# Altium schematic sheet OBC Subsystem_AVR.SchDoc
size A1; SheetNumber: 1; SheetTotal: 1
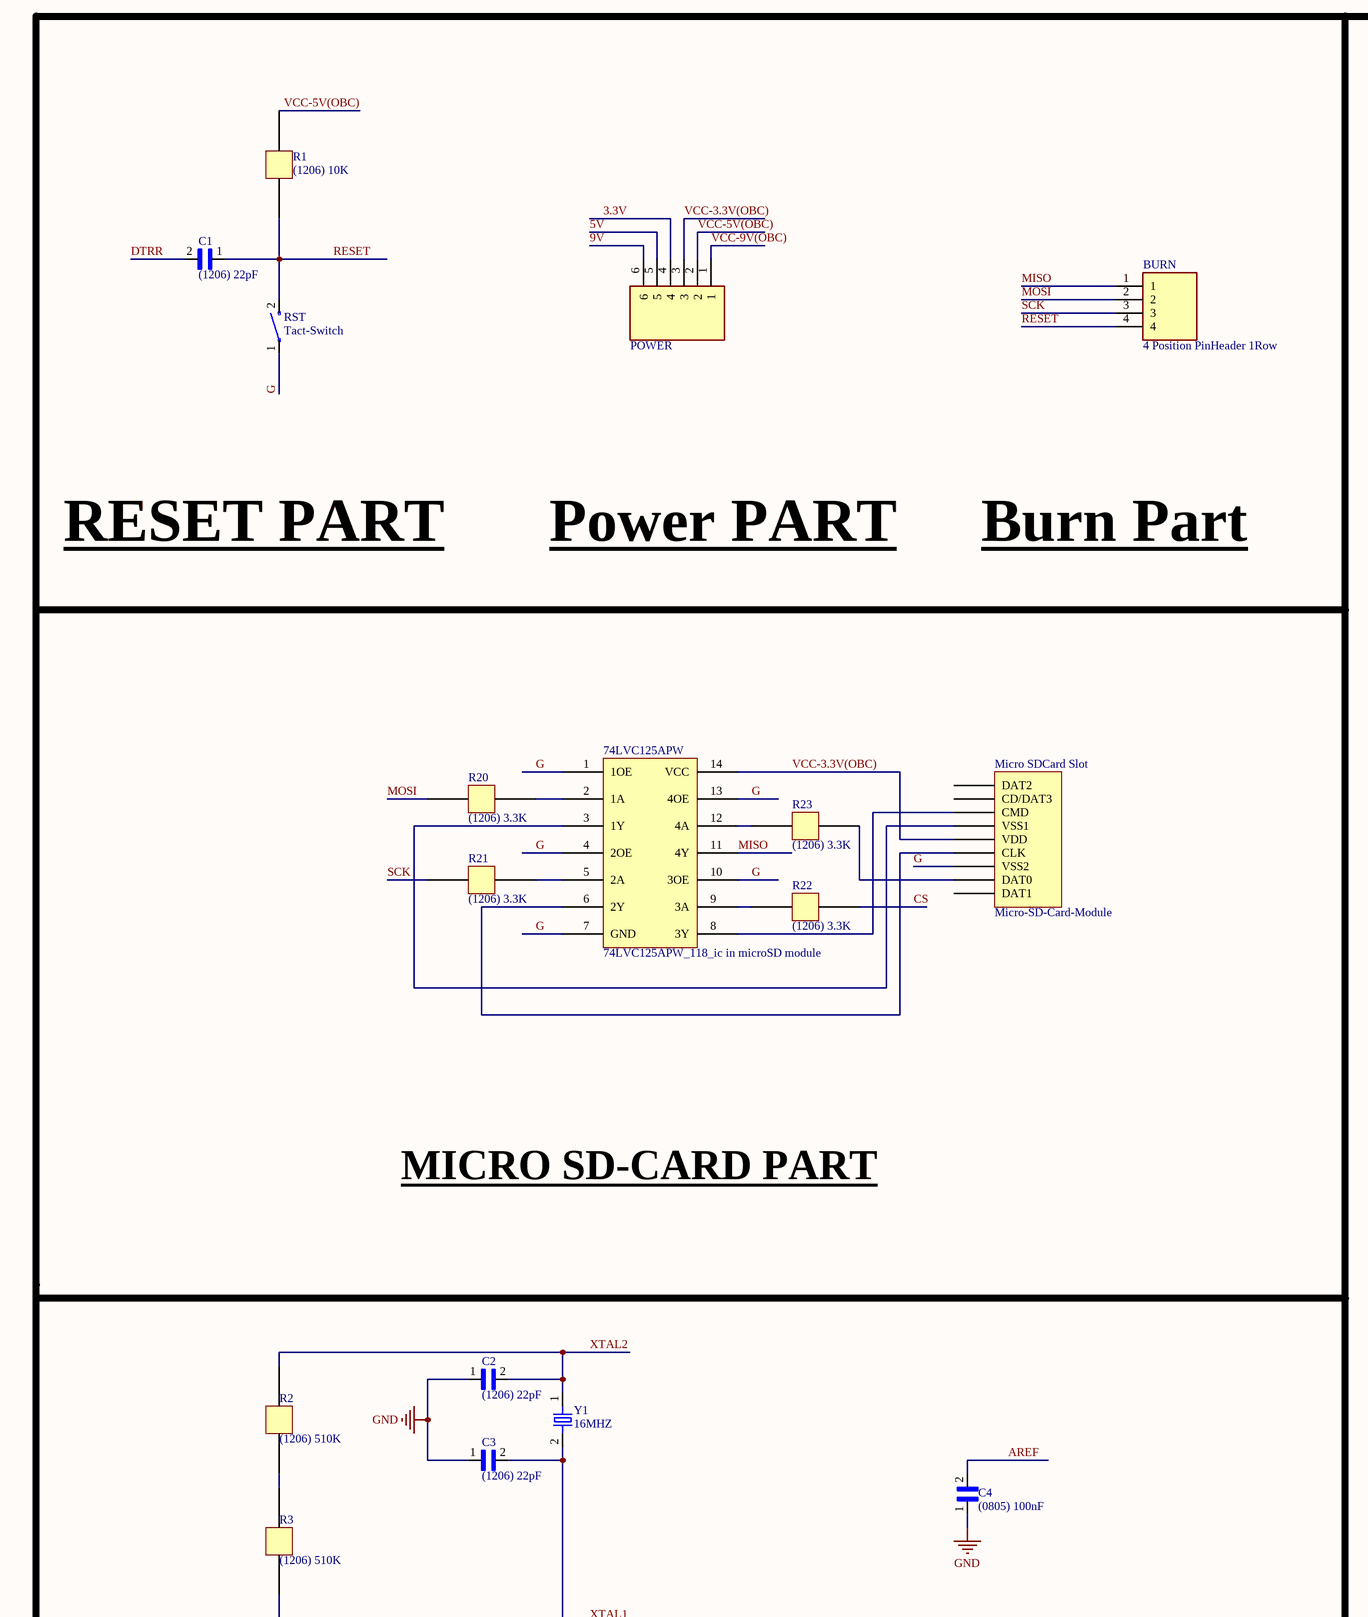
[diagram p0: OBC Subsystem_AVR.SchDoc, top left]
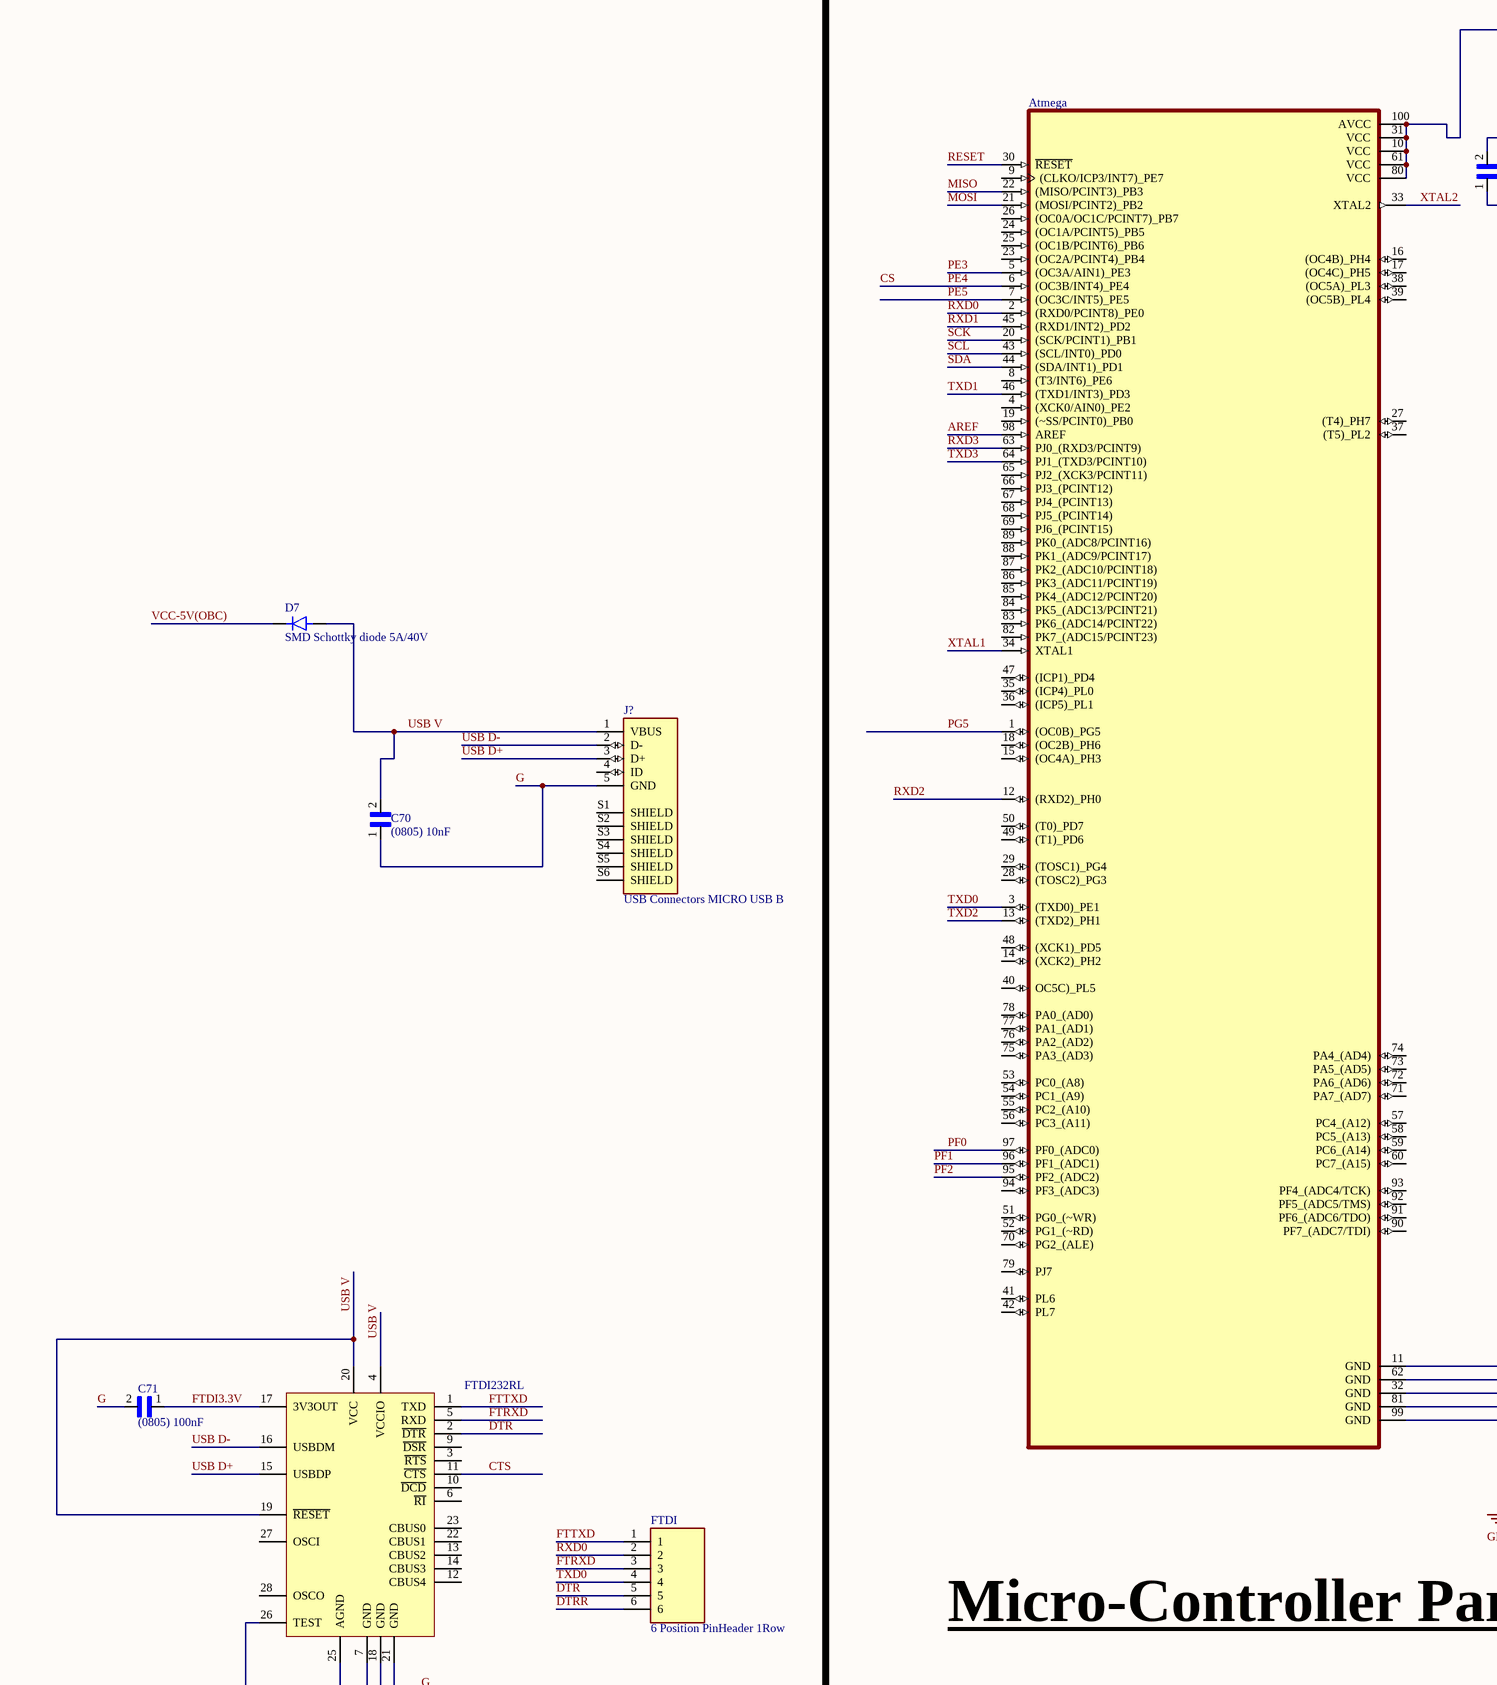
[diagram p1: OBC Subsystem_AVR.SchDoc, top middle]
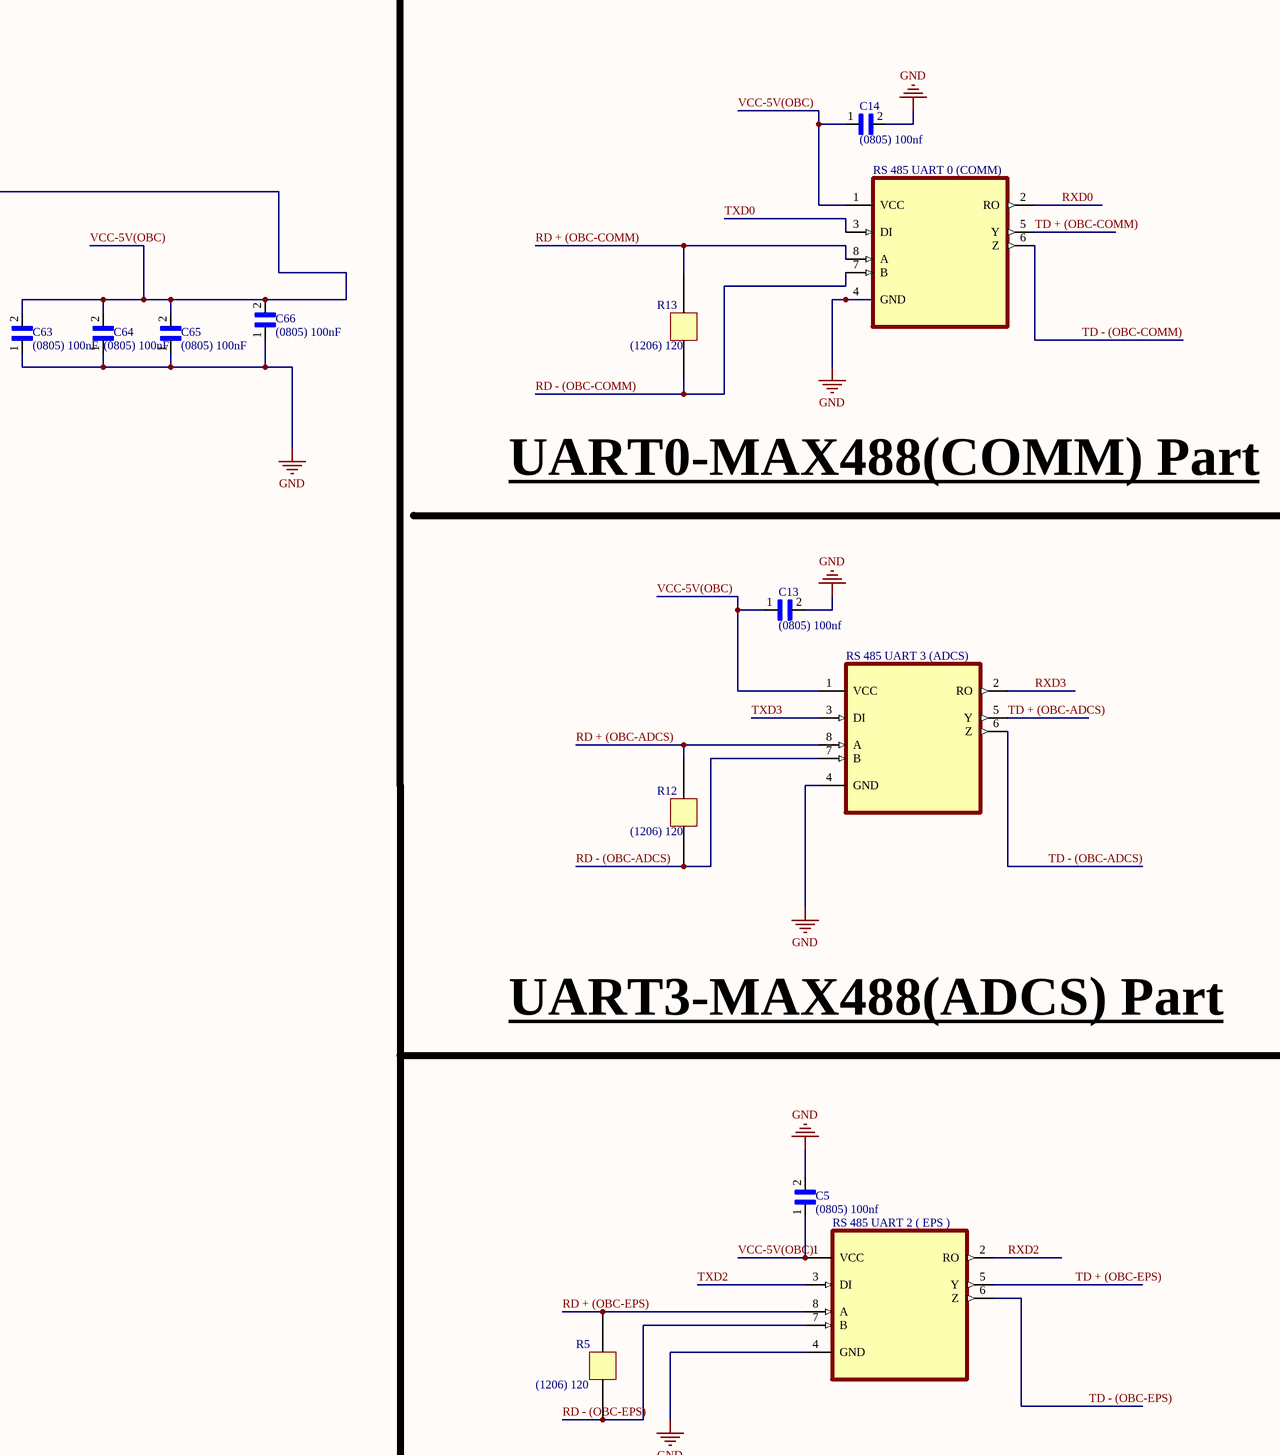
[diagram p2: OBC Subsystem_AVR.SchDoc, top right]
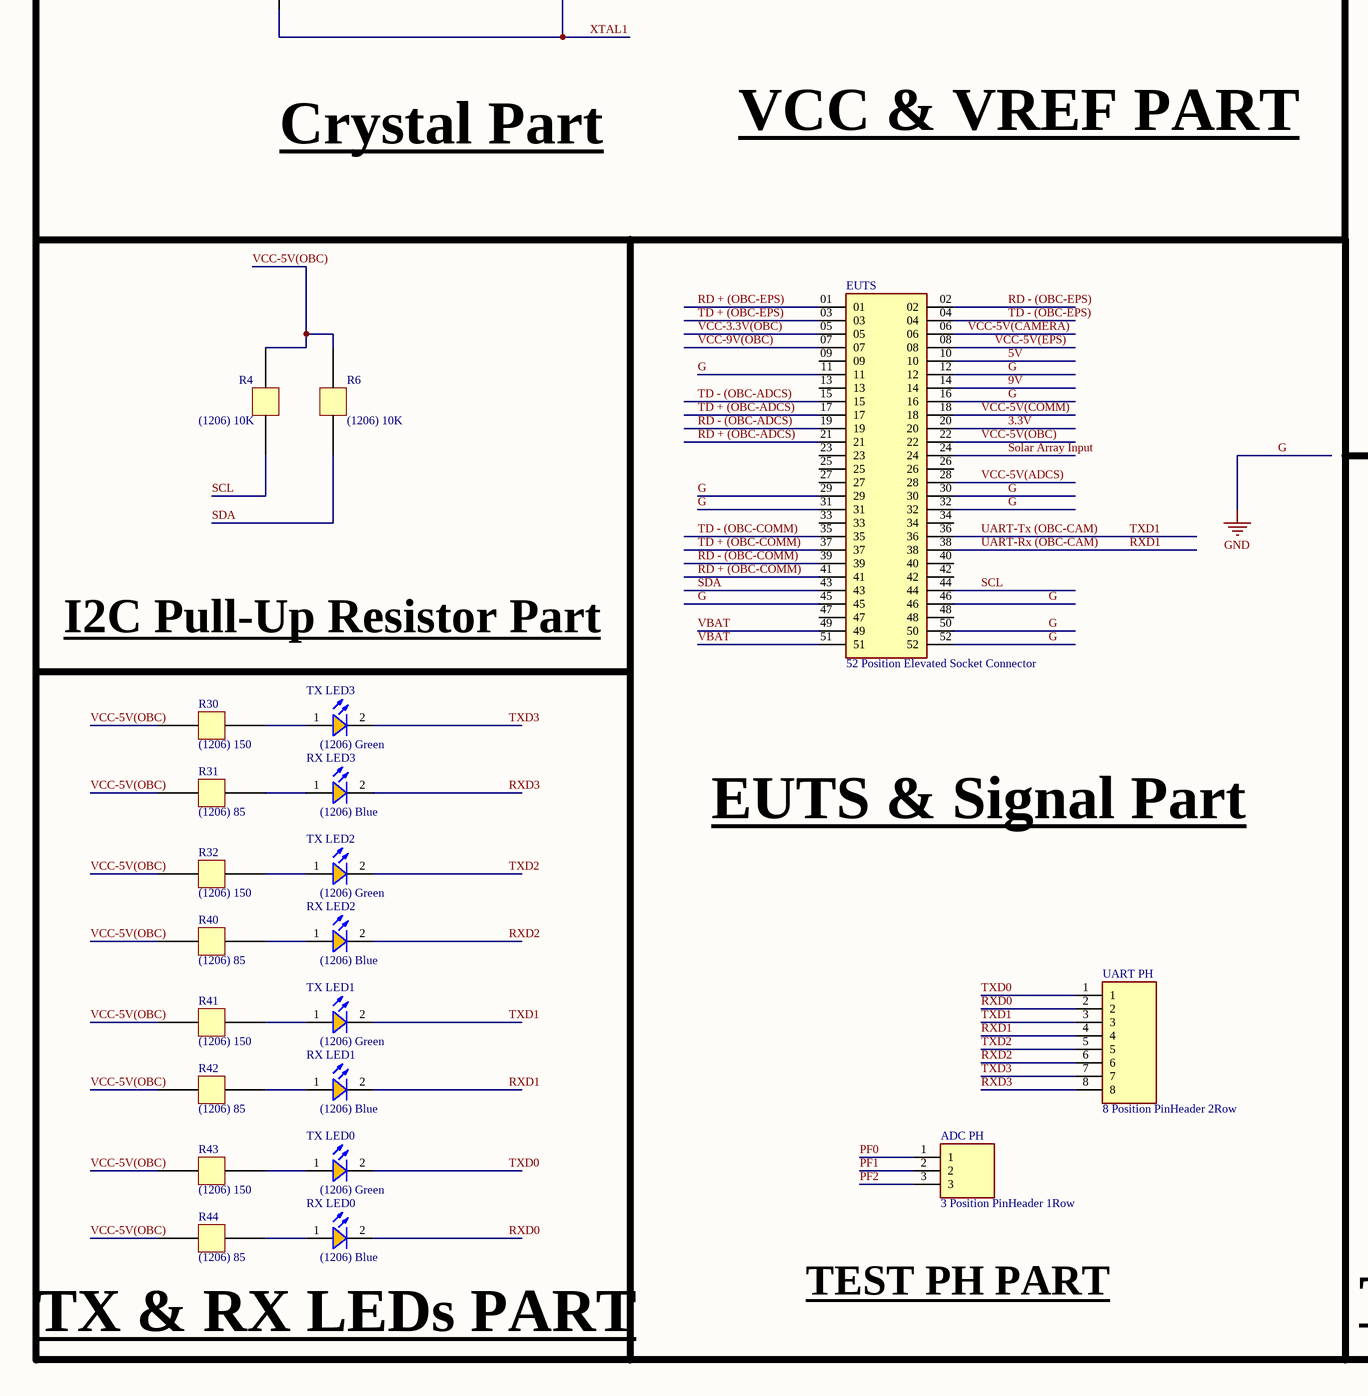
[diagram p3: OBC Subsystem_AVR.SchDoc, bottom left]
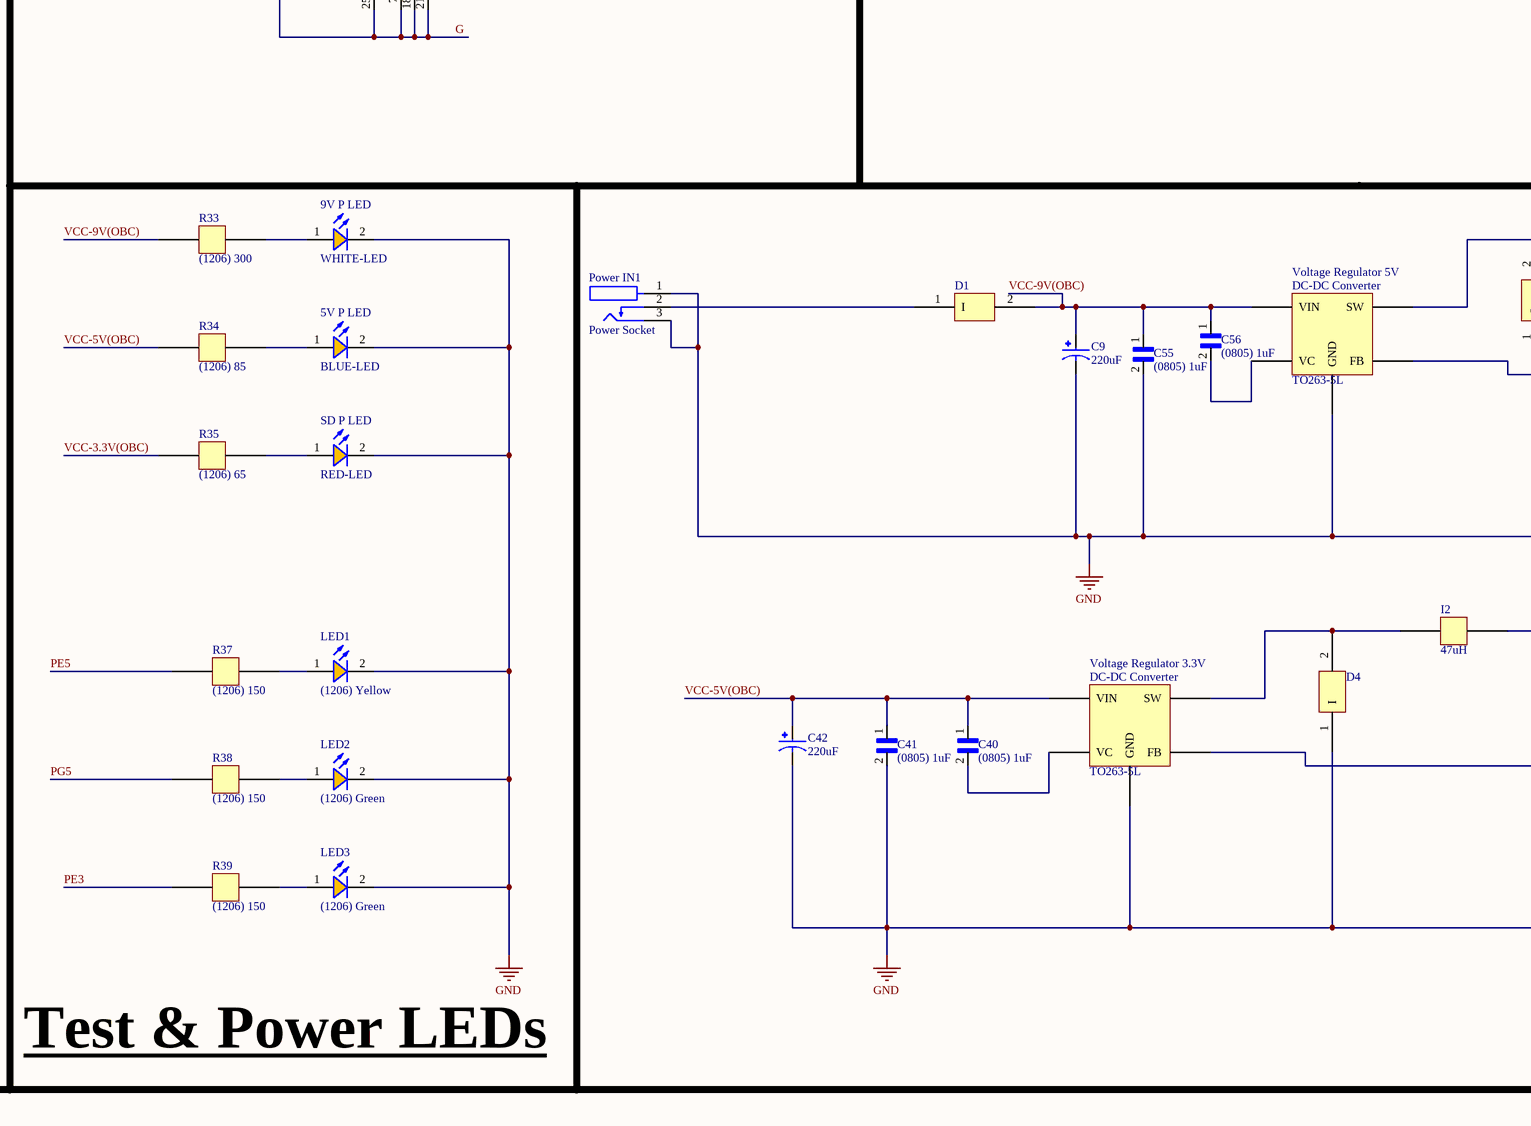
[diagram p4: OBC Subsystem_AVR.SchDoc, bottom middle]
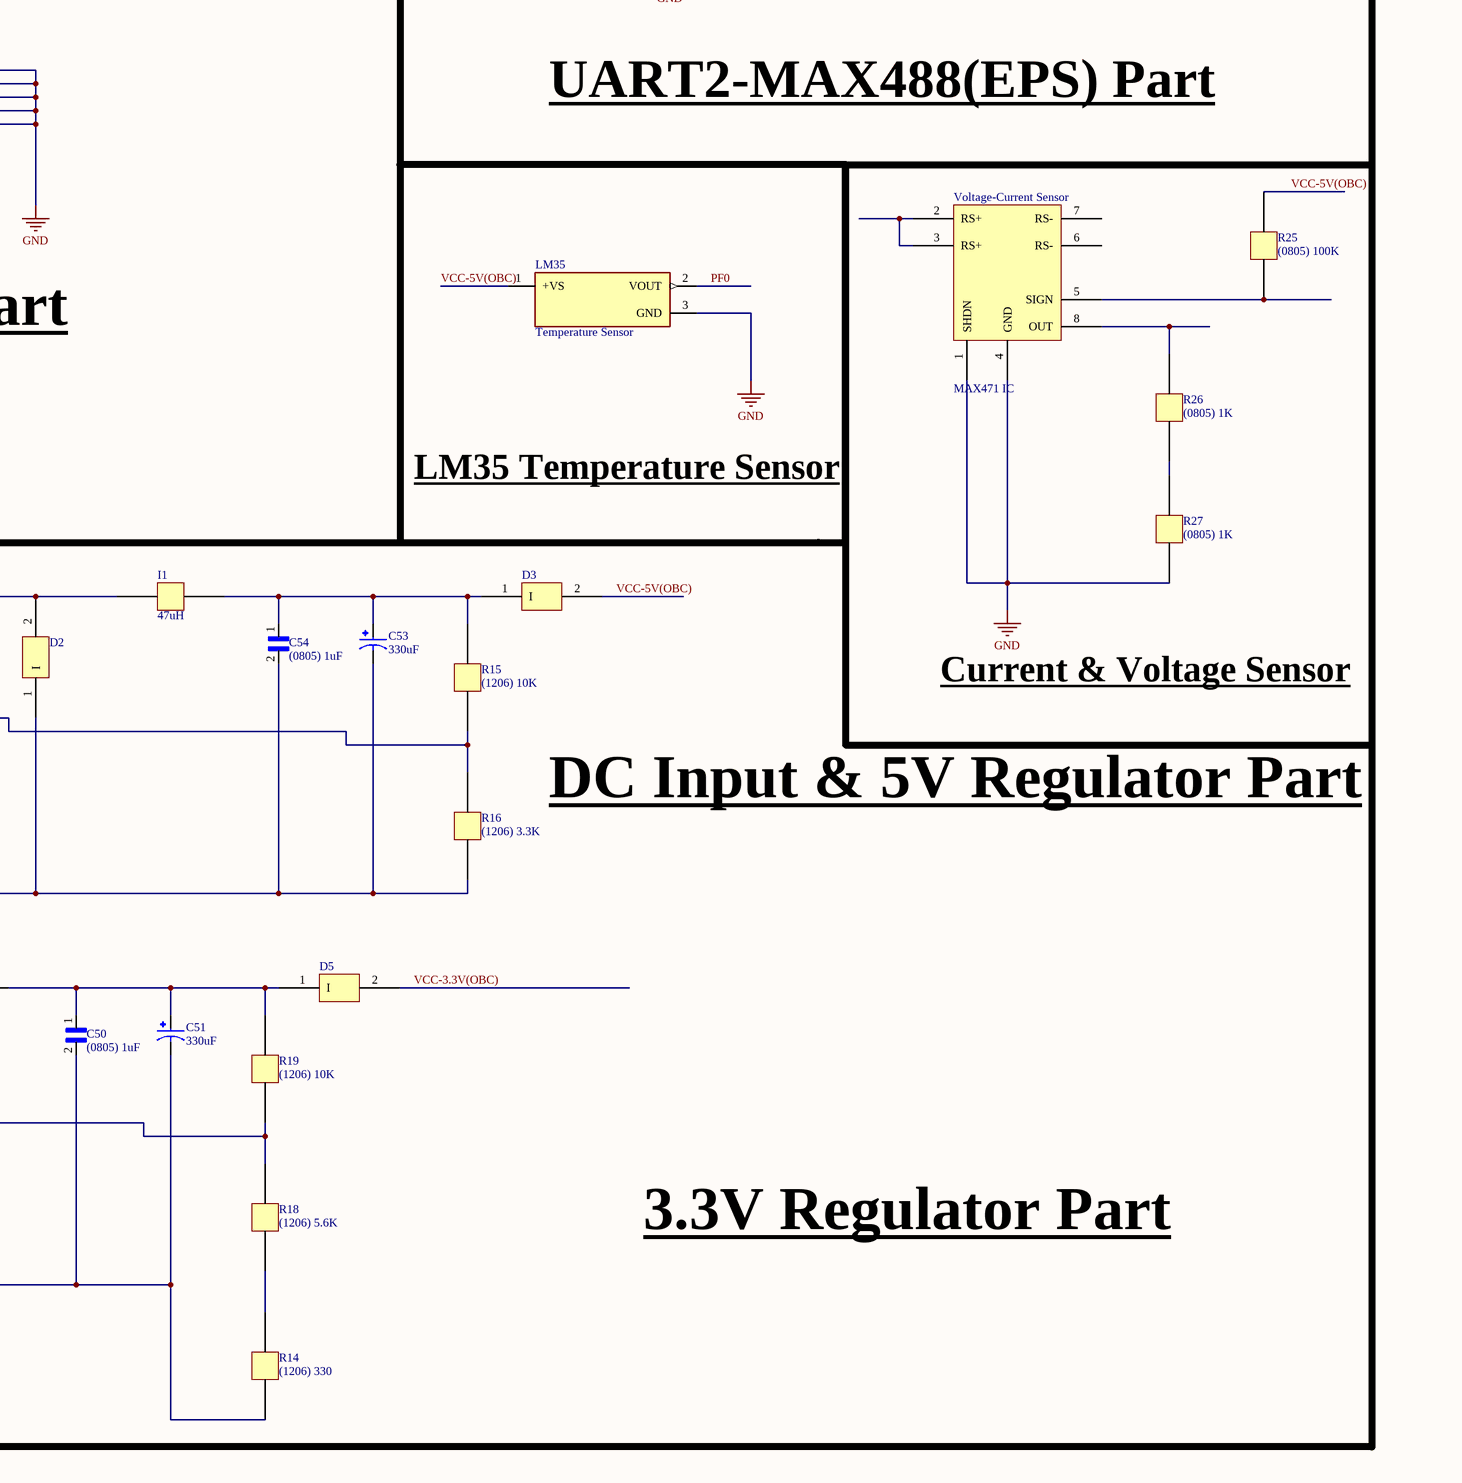
[diagram p5: OBC Subsystem_AVR.SchDoc, bottom right]

## Parts
5V_P_LED  BLUE-LED  [RESC3015X65-01]
9V_P_LED  WHITE-LED  [RESC3015X65-01]
74LVC125APW  74LVC125APW_118_ic in microSD module  [SOP65P640X110-14N]
ADC_PH  3 Position PinHeader 1Row  [TE_3-103327-3]
Atmega  (no value)  [QFP50P1600X1600X120-100N]
BURN  4 Position PinHeader 1Row  [TE_3-644456-4]
C1  (1206) 22pF  [CAPC3216X125N0]
C2  (1206) 22pF  [CAPC3216X125N0]
C3  (1206) 22pF  [CAPC3216X125N0]
C4  (0805) 100nF  [CAPC2012X95N-0]
C5  (0805) 100nf  [CAPC2012X95N-0]
C9  220uF  [CAPPRD500W60D1250H2500]
C13  (0805) 100nf  [CAPC2012X95N-0]
C14  (0805) 100nf  [CAPC2012X95N-0]
C40  (0805) 1uF  [CAPC2012X95N-0]
C41  (0805) 1uF  [CAPC2012X95N-0]
C42  220uF  [CAPPRD500W60D1250H2500]
C50  (0805) 1uF  [CAPC2012X95N-0]
C51  330uF  [CAPPRD500W60D1250H2500]
C53  330uF  [CAPPRD500W60D1250H2500]
C54  (0805) 1uF  [CAPC2012X95N-0]
C55  (0805) 1uF  [CAPC2012X95N-0]
C56  (0805) 1uF  [CAPC2012X95N-0]
C63  (0805) 100nF  [CAPC2012X95N-0]
C64  (0805) 100nF  [CAPC2012X95N-0]
C65  (0805) 100nF  [CAPC2012X95N-0]
C66  (0805) 100nF  [CAPC2012X95N-0]
C70  (0805) 10nF  [CAPC2012X95N-0]
C71  (0805) 100nF  [CAPC2012X95N-0]
D1  (no value)  [Diode_4148]
D2  (no value)  [Diode_4148]
D3  (no value)  [Diode_4148]
D4  (no value)  [Diode_4148]
D5  (no value)  [Diode_4148]
D7  SMD Schottky diode 5A/40V  [DIOM5227X270N]
EUTS  52 Position Elevated Socket Connector  [SAMTEC_ESQ-126-39-G-D]
FTDI  6 Position PinHeader 1Row  [TE_6-146285-6]
FTDI232RL  IC_FT232RL  [SSOP-28]  (value not drawn)
I1  47uH  [IND]
I2  47uH  [IND]
J?  USB Connectors MICRO USB B  [MOLEX_47346-0001]
LED1  (1206) Yellow  [RESC3015X65-01]
LED2  (1206) Green  [RESC3015X65-01]
LED3  (1206) Green  [RESC3015X65-01]
LM35  Temperature Sensor  [TO92127P521H735-4]
Micro_SDCard_Slot  Micro-SD-Card-Module  [SD-Card-Module]
POWER  6 Position PinHeader 1Row  [TE_6-146285-6]  (value not drawn)
Power_IN1  Power Socket  [GRAVITECH_CON-SOCJ-2155]
R1  (1206) 10K  [CAPC3216X125N0]
R2  (1206) 510K  [CAPC3216X125N0]
R3  (1206) 510K  [CAPC3216X125N0]
R4  (1206) 10K  [CAPC3216X125N0]
R5  (1206) 120  [CAPC3216X125N0]
R6  (1206) 10K  [CAPC3216X125N0]
R12  (1206) 120  [CAPC3216X125N0]
R13  (1206) 120  [CAPC3216X125N0]
R14  (1206) 330  [CAPC3216X125N0]
R15  (1206) 10K  [CAPC3216X125N0]
R16  (1206) 3.3K  [CAPC3216X125N0]
R18  (1206) 5.6K  [CAPC3216X125N0]
R19  (1206) 10K  [CAPC3216X125N0]
R20  (1206) 3.3K  [CAPC3216X125N0]
R21  (1206) 3.3K  [CAPC3216X125N0]
R22  (1206) 3.3K  [CAPC3216X125N0]
R23  (1206) 3.3K  [CAPC3216X125N0]
R25  (0805) 100K  [CAPC2012X95N-0]
R26  (0805) 1K  [CAPC2012X95N-0]
R27  (0805) 1K  [CAPC2012X95N-0]
R30  (1206) 150  [CAPC3216X125N0]
R31  (1206) 85  [CAPC3216X125N0]
R32  (1206) 150  [CAPC3216X125N0]
R33  (1206) 300  [CAPC3216X125N0]
R34  (1206) 85  [CAPC3216X125N0]
R35  (1206) 65  [CAPC3216X125N0]
R37  (1206) 150  [CAPC3216X125N0]
R38  (1206) 150  [CAPC3216X125N0]
R39  (1206) 150  [CAPC3216X125N0]
R40  (1206) 85  [CAPC3216X125N0]
R41  (1206) 150  [CAPC3216X125N0]
R42  (1206) 85  [CAPC3216X125N0]
R43  (1206) 150  [CAPC3216X125N0]
R44  (1206) 85  [CAPC3216X125N0]
RS_485_UART_0_(COMM)  (no value)  [SOIC127P600X175-8N0]
RS_485_UART_2_(_EPS_)  (no value)  [SOIC127P600X175-8N0]
RS_485_UART_3_(ADCS)  (no value)  [SOIC127P600X175-8N0]
RST  Tact-Switch  [Tact Switch]
RX_LED0  (1206) Blue  [RESC3015X65-01]
RX_LED1  (1206) Blue  [RESC3015X65-01]
RX_LED2  (1206) Blue  [RESC3015X65-01]
RX_LED3  (1206) Blue  [RESC3015X65-01]
SD_P_LED  RED-LED  [RESC3015X65-01]
TX_LED0  (1206) Green  [RESC3015X65-01]
TX_LED1  (1206) Green  [RESC3015X65-01]
TX_LED2  (1206) Green  [RESC3015X65-01]
TX_LED3  (1206) Green  [RESC3015X65-01]
UART_PH  8 Position PinHeader 2Row  [TE_8-146256-8]
Voltage-Current_Sensor  MAX471 IC  [SOIC127P600X168-8N]
Voltage_Regulator_3.3V  Voltage Regulator  [TO-263-5]  (value not drawn)
Voltage_Regulator_5V  Voltage Regulator  [TO-263-5]  (value not drawn)
Y1  16MHZ  [XTAL1140X490X430N-0]

## Nets
G: 5V_P_LED.2(K) 9V_P_LED.2(K) 74LVC125APW.1(1OE) 74LVC125APW.4(2OE) 74LVC125APW.7(GND) 74LVC125APW.10(3OE) 74LVC125APW.13(4OE) Atmega.11(GND) Atmega.32(GND) Atmega.62(GND) Atmega.81(GND) Atmega.99(GND) C2.1 C3.1 C4.1 C5.2 C9.N C13.2 C14.2 C41.2 C42.N C50.2 C51.N C53.N C54.2 C55.2 C63.1 C64.1 C65.1 C66.1 C70.1 C71.2 D2.1(I) D4.1(I) EUTS.11 EUTS.12 EUTS.16 EUTS.29 EUTS.30 EUTS.31 EUTS.32 EUTS.45 EUTS.46 EUTS.50 EUTS.52 FTDI232RL.7(GND) FTDI232RL.18(GND) FTDI232RL.21(GND) FTDI232RL.25(AGND) FTDI232RL.26(TEST) J?.5(GND) LED1.2(K) LED2.2(K) LED3.2(K) LM35.3(GND) Micro_SDCard_Slot.6(VSS2) Power_IN1.1 Power_IN1.3 R14.1 R16.1 R27.1 RS_485_UART_0_(COMM).4(GND) RS_485_UART_2_(_EPS_).4(GND) RS_485_UART_3_(ADCS).4(GND) RST.1 SD_P_LED.2(K) Voltage-Current_Sensor.1(SHDN) Voltage-Current_Sensor.4(GND) Voltage_Regulator_3.3V.1(GND) Voltage_Regulator_5V.1(GND)  [also labelled GND]
NC: FTDI232RL.8(NC) FTDI232RL.24(NC)
3.3V: EUTS.20 POWER.4
5V: EUTS.10 POWER.5
9V: EUTS.14 POWER.6
AREF: Atmega.98(AREF) C4.2
CS: Atmega.6((OC3B/INT4)_PE4) R22.2  [also labelled PE4]
CTS: FTDI232RL.11(~{CTS})
DTR: FTDI.5 FTDI232RL.2(~{DTR})
DTRR: C1.2 FTDI.6
FTDI3.3V: C71.1 FTDI232RL.17(3V3OUT)
FTRXD: FTDI.3 FTDI232RL.5(RXD)
FTTXD: FTDI.1 FTDI232RL.1(TXD)
MISO: 74LVC125APW.11(4Y) Atmega.22((MISO/PCINT3)_PB3) BURN.1
MOSI: Atmega.21((MOSI/PCINT2)_PB2) BURN.2 R20.1
PE3: Atmega.5((OC3A/AIN1)_PE3) R39.1
PE5: Atmega.7((OC3C/INT5)_PE5) R37.1
PF0: ADC_PH.1 Atmega.97(PF0_(ADC0)) LM35.2(VOUT)
PF1: ADC_PH.2 Atmega.96(PF1_(ADC1))
PF2: ADC_PH.3 Atmega.95(PF2_(ADC2))
PG5: Atmega.1((OC0B)_PG5) R38.1
RD + (OBC-ADCS): EUTS.21 R12.2 RS_485_UART_3_(ADCS).8(A)
RD + (OBC-COMM): EUTS.41 R13.2 RS_485_UART_0_(COMM).8(A)
RD + (OBC-EPS): EUTS.01 R5.2 RS_485_UART_2_(_EPS_).8(A)
RD - (OBC-ADCS): EUTS.19 R12.1 RS_485_UART_3_(ADCS).7(B)
RD - (OBC-COMM): EUTS.39 R13.1 RS_485_UART_0_(COMM).7(B)
RD - (OBC-EPS): EUTS.02 R5.1 RS_485_UART_2_(_EPS_).7(B)
RESET: Atmega.30(~{RESET}) BURN.4 C1.1 R1.2 RST.2
RXD0: Atmega.2((RXD0/PCINT8)_PE0) FTDI.2 RS_485_UART_0_(COMM).2(RO) RX_LED0.2(K) UART_PH.2
RXD1: Atmega.45((RXD1/INT2)_PD2) EUTS.38 RX_LED1.2(K) UART_PH.4  [also labelled UART-Rx (OBC-CAM)]
RXD2: Atmega.12((RXD2)_PH0) RS_485_UART_2_(_EPS_).2(RO) RX_LED2.2(K) UART_PH.6
RXD3: Atmega.63(PJ0_(RXD3/PCINT9)) RS_485_UART_3_(ADCS).2(RO) RX_LED3.2(K) UART_PH.8
SCK: Atmega.20((SCK/PCINT1)_PB1) BURN.3 R21.1
SCL: Atmega.43((SCL/INT0)_PD0) EUTS.44 R4.2
SDA: Atmega.44((SDA/INT1)_PD1) EUTS.43 R6.2
Solar Array Input: EUTS.24
TD + (OBC-ADCS): EUTS.17 RS_485_UART_3_(ADCS).5(Y)
TD + (OBC-COMM): EUTS.37 RS_485_UART_0_(COMM).5(Y)
TD + (OBC-EPS): EUTS.03 RS_485_UART_2_(_EPS_).5(Y)
TD - (OBC-ADCS): EUTS.15 RS_485_UART_3_(ADCS).6(Z)
TD - (OBC-COMM): EUTS.35 RS_485_UART_0_(COMM).6(Z)
TD - (OBC-EPS): EUTS.04 RS_485_UART_2_(_EPS_).6(Z)
TXD0: Atmega.3((TXD0)_PE1) FTDI.4 RS_485_UART_0_(COMM).3(DI) TX_LED0.2(K) UART_PH.1
TXD1: Atmega.46((TXD1/INT3)_PD3) EUTS.36 TX_LED1.2(K) UART_PH.3  [also labelled UART-Tx (OBC-CAM)]
TXD2: Atmega.13((TXD2)_PH1) RS_485_UART_2_(_EPS_).3(DI) TX_LED2.2(K) UART_PH.5
TXD3: Atmega.64(PJ1_(TXD3/PCINT10)) RS_485_UART_3_(ADCS).3(DI) TX_LED3.2(K) UART_PH.7
USB D+: FTDI232RL.15(USBDP) J?.3(D+)
USB D-: FTDI232RL.16(USBDM) J?.2(D-)
USB V: C70.2 D7.A FTDI232RL.4(VCCIO) FTDI232RL.19(~{RESET}) FTDI232RL.20(VCC) J?.1(VBUS)
VBAT: EUTS.49 EUTS.51
VCC-3.3V(OBC): 74LVC125APW.14(VCC) D5.2 EUTS.05 Micro_SDCard_Slot.4(VDD) POWER.3 R35.1
VCC-5V(ADCS): EUTS.28
VCC-5V(CAMERA): EUTS.06
VCC-5V(COMM): EUTS.18
VCC-5V(EPS): EUTS.08
VCC-5V(OBC): Atmega.10(VCC) Atmega.31(VCC) Atmega.61(VCC) Atmega.80(VCC) Atmega.100(AVCC) C5.1 C13.1 C14.1 C40.1 C41.1 C42.P C63.2 C64.2 C65.2 C66.2 D3.2 D7.C(K) EUTS.22 LM35.1(+VS) POWER.2 R1.1 R4.1 R6.1 R25.2 R30.1 R31.1 R32.1 R34.1 R40.1 R41.1 R42.1 R43.1 R44.1 RS_485_UART_0_(COMM).1(VCC) RS_485_UART_2_(_EPS_).1(VCC) RS_485_UART_3_(ADCS).1(VCC) Voltage_Regulator_3.3V.5(VIN)
VCC-9V(OBC): C9.P C55.1 C56.1 D1.2 EUTS.07 POWER.1 R33.1 Voltage_Regulator_5V.5(VIN)
XTAL1: Atmega.34(XTAL1) C3.2 R3.1 Y1.2
XTAL2: Atmega.33(XTAL2) C2.2 R2.2 Y1.1
Net5V_P_LED_1: 5V_P_LED.1(A) R34.2
Net9V_P_LED_1: 9V_P_LED.1(A) R33.2
Net74LVC125APW_2: 74LVC125APW.2(1A) R20.2
Net74LVC125APW_3: 74LVC125APW.3(1Y) Micro_SDCard_Slot.3(VSS1)
Net74LVC125APW_5: 74LVC125APW.5(2A) R21.2
Net74LVC125APW_6: 74LVC125APW.6(2Y) Micro_SDCard_Slot.5(CLK)
Net74LVC125APW_8: 74LVC125APW.8(3Y) Micro_SDCard_Slot.2(CMD)
Net74LVC125APW_9: 74LVC125APW.9(3A) R22.1
Net74LVC125APW_12: 74LVC125APW.12(4A) R23.1
NetC40_2: C40.2 Voltage_Regulator_3.3V.4(VC)
NetC50_1: C50.1 C51.P D5.1(I) I2.2 R19.2
NetC53_P: C53.P C54.1 D3.1(I) I1.2 R15.2
NetC56_2: C56.2 Voltage_Regulator_5V.4(VC)
NetD1_1: D1.1(I) Power_IN1.2
NetD2_2: D2.2 I1.1 Voltage_Regulator_5V.3(SW)
NetD4_2: D4.2 I2.1 Voltage_Regulator_3.3V.3(SW)
NetLED1_1: LED1.1(A) R37.2
NetLED2_1: LED2.1(A) R38.2
NetLED3_1: LED3.1(A) R39.2
NetMicro_SDCard_Slot_7: Micro_SDCard_Slot.7(DAT0) R23.2
NetR2_1: R2.1 R3.2
NetR14_2: R14.2 R18.1
NetR15_1: R15.1 R16.2 Voltage_Regulator_5V.2(FB)
NetR18_2: R18.2 R19.1 Voltage_Regulator_3.3V.2(FB)
NetR25_1: R25.1 Voltage-Current_Sensor.5(SIGN)
NetR26_1: R26.1 R27.2
NetR26_2: R26.2 Voltage-Current_Sensor.8(OUT)
NetR30_2: R30.2 TX_LED3.1(A)
NetR31_2: R31.2 RX_LED3.1(A)
NetR32_2: R32.2 TX_LED2.1(A)
NetR35_2: R35.2 SD_P_LED.1(A)
NetR40_2: R40.2 RX_LED2.1(A)
NetR41_2: R41.2 TX_LED1.1(A)
NetR42_2: R42.2 RX_LED1.1(A)
NetR43_2: R43.2 TX_LED0.1(A)
NetR44_2: R44.2 RX_LED0.1(A)
NetVoltage-Current_Sensor_2: Voltage-Current_Sensor.2(RS+) Voltage-Current_Sensor.3(RS+)

Not connected (* = marked no-connect by the designer): Atmega 4((XCK0/AIN0)_PE2) 8((T3/INT6)_PE6) 9((CLKO/ICP3/INT7)_PE7) 14((XCK2)_PH2) 15((OC4A)_PH3) 16((OC4B)_PH4) 17((OC4C)_PH5) 18((OC2B)_PH6) 19((~SS/PCINT0)_PB0) 23((OC2A/PCINT4)_PB4) 24((OC1A/PCINT5)_PB5) 25((OC1B/PCINT6)_PB6) 26((OC0A/OC1C/PCINT7)_PB7) 27((T4)_PH7) 28((TOSC2)_PG3) 29((TOSC1)_PG4) 35((ICP4)_PL0) 36((ICP5)_PL1) 37((T5)_PL2) 38((OC5A)_PL3) 39((OC5B)_PL4) 40(OC5C)_PL5) 41(PL6) 42(PL7) 47((ICP1)_PD4) 48((XCK1)_PD5) 49((T1)_PD6) 50((T0)_PD7) 51(PG0_(~WR)) 52(PG1_(~RD)) 53(PC0_(A8)) 54(PC1_(A9)) 55(PC2_(A10)) 56(PC3_(A11)) 57(PC4_(A12)) 58(PC5_(A13)) 59(PC6_(A14)) 60(PC7_(A15)) 65(PJ2_(XCK3/PCINT11)) 66(PJ3_(PCINT12)) 67(PJ4_(PCINT13)) 68(PJ5_(PCINT14)) 69(PJ6_(PCINT15)) 70(PG2_(ALE)) 71(PA7_(AD7)) 72(PA6_(AD6)) 73(PA5_(AD5)) 74(PA4_(AD4)) 75(PA3_(AD3)) 76(PA2_(AD2)) 77(PA1_(AD1)) 78(PA0_(AD0)) 79(PJ7) 82(PK7_(ADC15/PCINT23)) 83(PK6_(ADC14/PCINT22)) 84(PK5_(ADC13/PCINT21)) 85(PK4_(ADC12/PCINT20)) 86(PK3_(ADC11/PCINT19)) 87(PK2_(ADC10/PCINT18)) 88(PK1_(ADC9/PCINT17)) 89(PK0_(ADC8/PCINT16)) 90(PF7_(ADC7/TDI)) 91(PF6_(ADC6/TDO)) 92(PF5_(ADC5/TMS)) 93(PF4_(ADC4/TCK)) 94(PF3_(ADC3)); EUTS 09 13 23 25 26 27 33 34 40 42 47 48; FTDI232RL 3(~{RTS}) 6(~{RI}) 9(~{DSR}) 10(~{DCD}) 12(CBUS4) 13(CBUS2) 14(CBUS3) 22(CBUS1) 23(CBUS0) 27(OSCI) 28(OSCO); J? 4(ID) S1(SHIELD) S2(SHIELD) S3(SHIELD) S4(SHIELD) S5(SHIELD) S6(SHIELD); Micro_SDCard_Slot 1(CD/DAT3) 8(DAT1) 9(DAT2); Voltage-Current_Sensor 6(RS-) 7(RS-)

## Notes on the sheet
- RESET PART
- Power PART
- Burn Part
- UART0-MAX488(COMM) Part
- UART3-MAX488(ADCS) Part
- MICRO SD-CARD PART
- UART2-MAX488(EPS) Part
- VCC & VREF PART
- Crystal Part
- Micro-Controller Part
- LM35 Temperature Sensor
- Current & Voltage Sensor
- I2C Pull-Up Resistor Part
- DC Input & 5V Regulator Part
- EUTS & Signal Part
- 3.3V Regulator Part
- TX & RX LEDs PART
- TEST PH PART
- Test & Power LEDs
- (in symbol Voltage Regulator) DC-DC Converter; TO263-5L

## Library data of the parts
5V_P_LED 9V_P_LED LED1-LED3 RX_LED0-RX_LED3 SD_P_LED TX_LED0-TX_LED3 = LED 1206: LED SMD 1206 High Quality Forward Voltage: 3.2 V / Brightness: 700 mcd; Manufacturer: Wurth Elektronik; Manufacturer Part Number: 150060AS75003; Chip Technology: AlInGaP; Dominant Wavelength: 605nm; Emitting Color: Amber; Forward Voltage: 2V; Luminous Intensity: 350mcd; Peak Wavelength: 610nm; Viewing Angle: 140°; ComponentLink1Description: Manufacturer Link; ComponentLink1URL: http://www.we-online.de; ComponentLink2Description: Datasheet; ComponentLink2URL: https://www.we-online.com/catalog/datasheet/150060AS75003.pdf; Height: 0.7mm; Length: 1.6mm; Mounting Technology: SMT; Operating Temperature max.: 100C; Operating Temperature min.: -40C; Packaging: Tape and Reel; Size: 0603; Width: 0.8mm
ADC_PH = 3 Position PinHeader 1Row: Conn Unshrouded Header HDR 3 POS 2.54mm Solder ST Thru-Hole Carton; MF: TE Connectivity; MP: 4-103327-5; Package: None; Value: *; TE_purchase_URL: https://www.te.com/usa-en/product-4-103327-5.html?te_bu=Cor&te_type=disp&te_campaign=seda_glo_cor-seda-global-disp-prtnr-fy19-seda-model-bom-cta_sma-317_1&elqCampaignId=32493; Price: None; SnapEDA_Link: https://www.snapeda.com/parts/4-103327-5/TE%20Connectivity%20AMP%20Connectors/view-part/2403997/?ref=snap; Availability: Unavailable; EU_RoHS_Compliance: Compliant
Atmega = ATMEGA2560-16AU: Value: *; MP: ATMEGA2560-16AU; Package: None; Availability: Unavailable; Price: None
BURN = 4 Position PinHeader 1Row: Conn Unshrouded Header HDR 4 POS 2.54mm Solder ST Thru-Hole Bag/Box; MP: 3-644456-4; Number_of_Positions: 4; Product_Type: Connector; MF: TE Connectivity; Centerline_Pitch: 2.54 mm[.1 in]; Package: None; Availability: Warning; EU_RoHS_Compliance: Compliant; SnapEDA_Link: https://www.snapeda.com/parts/3-644456-4/TE%20Connectivity%20AMP%20Connectors/view-part/482664/?ref=snap; DigiKey-Purchase-URL: https://snapeda.com/shop?store=DigiKey&id=482664; Mouser-Purchase-URL: https://snapeda.com/shop?store=Mouser&id=482664; Price: None; Value: *
C1-C3 = Capacitor 1206: UMF316B7103KFHT/1206 Capacitor; Package: None; Price: None; Value: *; MP: UMF316B7103KFHT; Availability: Unavailable
C4 C5 C13 C14 C40 C41 C50 C54-C56 C63-C66 C70 C71 = Capacitor 0805: UMK212SD103KD-T/CAP CER 10000PF 50V 0805; Package: None; Price: None; Value: *; MP: UMK212SD103KD-T; Availability: Unavailable
C9 C42 C51 C53 = Aluminum Electrolytic Capacitor: Aluminum Electrolytic Capacitors - Radial Leaded 47uF 250volts AEC-Q200; MP: EEUEB2E470B; MF: Panasonic; Availability: In Stock; SnapEDA_Link: https://www.snapeda.com/parts/EEUEB2E470B/Panasonic/view-part/?ref=snap; Value: *; Price: None; Package: RADIAL-2 Panasonic; Check_prices: https://www.snapeda.com/parts/EEUEB2E470B/Panasonic/view-part/?ref=eda
D1-D5 = Diode 4148
D7 = SMD Schottky diode 5A/40V: S1 Series 1000 V 1 A 1 uA Surface Mount General Purpose Rectifier - DO-214AC; MP: S1M; Price: None; Value: *; Availability: Unavailable; Package: None
EUTS = 52 Position Elevated Socket Connector: ESQ-126-39-G-D/52 Position Elevated Socket Connector Through Hole; MF: Samtec; Package: None; MP: ESQ-126-39-G-D; Value: *; Availability: Unavailable; Price: None; SnapEDA_Link: https://www.snapeda.com/parts/ESQ-126-39-G-D/Samtec%20Inc./view-part/490181/?ref=snap
FTDI POWER = 6 Position PinHeader 1Row: Connector Header Through Hole 6 position 0.100 (2.54mm); MP: 5-146285-6; MF: TE Connectivity; DigiKey-Purchase-URL: https://snapeda.com/shop?store=DigiKey&id=2411669; EU_RoHS_Compliance: Compliant; Package: None; Value: *; SnapEDA_Link: https://www.snapeda.com/parts/5-146285-6/TE%20Connectivity%20AMP%20Connectors/view-part/2411669/?ref=snap; Digi-Key_Part_Number: A122872-ND
  POWER: Check_prices: https://www.snapeda.com/parts/5-146285-6/TE%20Connectivity%20AMP%20Connectors/view-part/2411669/?ref=eda
FTDI232RL = IC_FT232RL: FT232R USB UART; Manufacturer: *; Note: *; ManufacturerPartNo: *
I1 I2 = Inductor DIP
J? = USB Connectors MICRO USB B: USB Connectors MICRO USB B RECPT BTTM MOUNT ASSY; MP: 47346-0001; MF: Molex; Package: None; Purchase-URL: https://pricing.snapeda.com/search/part/47346-0001/?ref=eda; Check_prices: https://www.snapeda.com/parts/47346-0001/Molex/view-part/53503/?ref=eda; Value: *; Availability: Warning; Price: None; SnapEDA_Link: https://www.snapeda.com/parts/47346-0001/Molex/view-part/53503/?ref=snap
LM35 = LM35DZ/NOPB/Temperature Sensor: LM35DZ/NOPB/Temperature Sensor Analog, Local 0Â°C ~ 100Â°C 10mV/Â°C TO-92-3; MF: Texas Instruments; MP: LM35DZ; Value: *; SnapEDA_Link: https://www.snapeda.com/parts/LM35DZ/Texas+Instruments/view-part/?ref=snap; Price: None; Availability: Not in stock; Package: E-PKG AXIAL-LEADED-2 ON Semiconductor; Check_prices: https://www.snapeda.com/parts/LM35DZ/Texas+Instruments/view-part/?ref=eda
Power_IN1 = Power Socket: CON-SOCJ-2155\DC Power Connectors Power Jack/Connector 2.1mm x 5.5mm; Price: None; Package: None; Availability: Unavailable; MP: CON-SOCJ-2155; Value: *
R1-R6 R12-R16 R18-R23 R30-R35 R37-R44 = Resistor 1206
R25-R27 = Resistor 0805
RS_485_UART_0_(COMM) RS_485_UART_2_(_EPS_) RS_485_UART_3_(ADCS) = MAX488ESA+: 1/1 Transceiver Full RS422, RS485 8-SOIC; MP: MAX488ESA+T; MF: Maxim Integrated; Price: None; Package: SOIC-8 Maxim; Availability: Unavailable; SnapEDA_Link: https://www.snapeda.com/parts/MAX488ESA+T/Maxim%20Integrated/view-part/48834/?ref=snap; Value: *
RST = Tact-Switch: High Quality 3x6x2.7 mm SMD White Push Button Switch (Tact Switch); MP: 1437566-3; Price: None; Value: *; Package: None; Availability: Unavailable
UART_PH = 8 Position PinHeader 2Row: 08 MODII HDR DRST B/A .100CL LF; MP: 5-146256-4; MF: TE Connectivity; Package: None; Availability: Unavailable; Value: *; Price: None; SnapEDA_Link: https://www.snapeda.com/parts/5-146256-4/TE%20Connectivity%20AMP%20Connectors/view-part/500529/?ref=snap
Voltage_Regulator_3.3V Voltage_Regulator_5V = Voltage Regulator: TO-263-5/XL4015E1 5A 75W Adjustable DC/DC STEP DOWN CONVERTER Regulator IC SMD
Y1 = Crystal 16MHZ